# Altium project 8805.PrjPCB
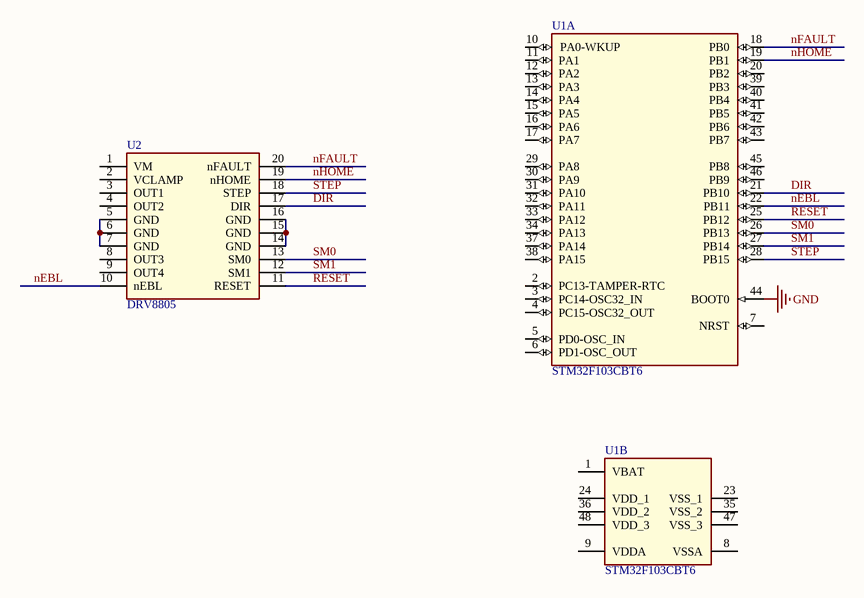
[diagram p0: 8805.SchDoc]
1 sheet, 2 parts. Net scope: global (net labels, ports and power ports of the same name join across sheets).

## Sheet 8805.SchDoc
size A3

### Parts
U1  STM32F103CBT6  [STM-LQFP48_N]  (parts A,B of 2)
U2  DRV8805

### Nets
GND: U1.44(BOOT0)
DIR: U1.21(PB10) U2.17(DIR)
nEBL: U1.22(PB11) U2.10(nEBL)
nFAULT: U1.18(PB0) U2.20(nFAULT)
nHOME: U1.19(PB1) U2.19(nHOME)
RESET: U1.25(PB12) U2.11(RESET)
SM0: U1.26(PB13) U2.13(SM0)
SM1: U1.27(PB14) U2.12(SM1)
STEP: U1.28(PB15) U2.18(STEP)
NetU2_5: U2.5(GND) U2.6(GND) U2.7(GND)
NetU2_14: U2.14(GND) U2.15(GND) U2.16(GND)

Not connected (* = marked no-connect by the designer): U1 1(VBAT) 2(PC13-TAMPER-RTC) 3(PC14-OSC32_IN) 4(PC15-OSC32_OUT) 5(PD0-OSC_IN) 6(PD1-OSC_OUT) 7(NRST) 8(VSSA) 9(VDDA) 10(PA0-WKUP) 11(PA1) 12(PA2) 13(PA3) 14(PA4) 15(PA5) 16(PA6) 17(PA7) 20(PB2) 23(VSS_1) 24(VDD_1) 29(PA8) 30(PA9) 31(PA10) 32(PA11) 33(PA12) 34(PA13) 35(VSS_2) 36(VDD_2) 37(PA14) 38(PA15) 39(PB3) 40(PB4) 41(PB5) 42(PB6) 43(PB7) 45(PB8) 46(PB9) 47(VSS_3) 48(VDD_3); U2 1(VM) 2(VCLAMP) 3(OUT1) 4(OUT2) 8(OUT3) 9(OUT4)

### Library data of the parts
U1 = STM32F103CBT6: ARM Cortex-M3 32-bit MCU, 128 KB Flash, 20 KB Internal RAM, 37 I/Os, 48-pin LQFP, -40 to 85 degC, Tray; A/D Converter: 2x12-bit (10 Channel); FLASH Size (Prog) (kB): 128; I/Os (High Current): 37; Internal RAM Size (kB): 20; Operating Frequency(F) (Processor speed) (MHz): 72; Supply Voltage(Vcc) min (V): 2; DatasheetVersion: Rev. 16; PackageVersion: Rev. 6, 06/2013; PackageReference: LQFP48; PackageDescription: 48-Pin Low Profile Quad Flat Package, 7 x 7 mm Body, 0.5 mm Pitch; Supplier 1: Digi-Key; Supplier Part Number 1: 497-6288-ND; Supplier 2: Farnell; Supplier Part Number 2: 1606327; Supplier 3: Newark; Supplier Part Number 3: 11N8296; Supplier 4: Newark; Supplier Part Number 4: 57P1214; Supplier 5: Mouser; Supplier Part Number 5: 511-STM32F103CBT6; Core: ARM Cortex-M3; Packing: Tray; Mounting Technology: Surface Mount; PartNumber: STM32F103CBT6; ComponentLink1Description: Manufacturer URL; ComponentLink1URL: http://www.st.com/web/en/home.html; ComponentLink2Description: Datasheet; ComponentLink2URL: http://www.st.com/st-web-ui/static/active/en/resource/technical/document/datasheet/CD00161566.pdf; ComponentLink3Description: Package Specification; ComponentLink3URL: http://www.st.com/st-web-ui/static/active/en/resource/technical/document/datasheet/DM00058181.pdf